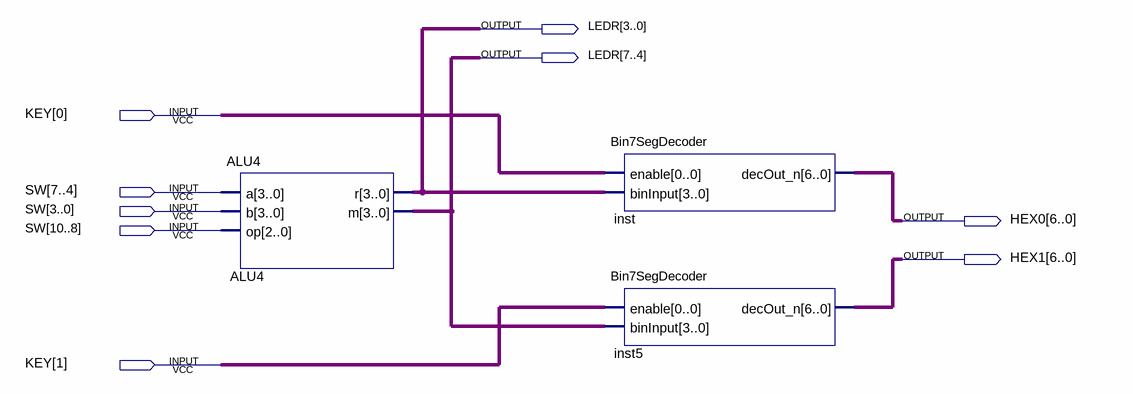
[diagram p0: schematic sheet]
// Quartus schematic ALUDemo.bdf as structural Verilog: 3 symbols, 9 pins
module ALUDemo (
  input  [1:0] KEY,
  input  [10:0] SW,
  output [7:0] LEDR,
  output [6:0] HEX0,
  output [6:0] HEX1
);

  ALU4 ALU4 (.a(SW[7:4]), .b(SW[3:0]), .op(SW[10:8]), .r(LEDR[3:0]), .m(LEDR[7:4]));
  Bin7SegDecoder inst (.enable(KEY[0]), .binInput(LEDR[3:0]), .decOut_n(HEX0));
  Bin7SegDecoder inst5 (.enable(KEY[1]), .binInput(LEDR[7:4]), .decOut_n(HEX1));
endmodule
